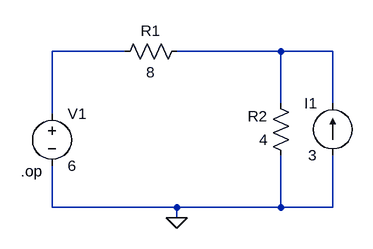
[diagram p0: schematic Superposition.asc]
Superposition.asc, the LTspice schematic file:
Version 4
SHEET 1 880 680
WIRE 240 160 128 160
WIRE 480 160 320 160
WIRE 560 160 480 160
WIRE 480 240 480 160
WIRE 560 240 560 160
WIRE 128 256 128 160
WIRE 128 400 128 336
WIRE 320 400 128 400
WIRE 480 400 480 320
WIRE 480 400 320 400
WIRE 560 400 560 320
WIRE 560 400 480 400
WIRE 320 416 320 400
FLAG 320 416 0
SYMBOL res 336 144 R90
WINDOW 0 0 56 VBottom 2
WINDOW 3 32 56 VTop 2
SYMATTR InstName R1
SYMATTR Value 8
SYMBOL res 496 336 R180
WINDOW 0 36 76 Left 2
WINDOW 3 36 40 Left 2
SYMATTR InstName R2
SYMATTR Value 4
SYMBOL voltage 128 240 R0
SYMATTR InstName V1
SYMATTR Value 6
SYMBOL current 560 320 R180
WINDOW 0 24 80 Left 2
WINDOW 3 24 0 Left 2
SYMATTR InstName I1
SYMATTR Value 3
TEXT 80 344 Left 2 !.op

The netlist it stands for:
* Superposition.asc
R1 N002 N001 8
R2 0 N002 4
V1 N001 0 6
I1 0 N002 3
.op
.backanno
.end